# Altium schematic sheet jtag_connector.SchDoc
size A4
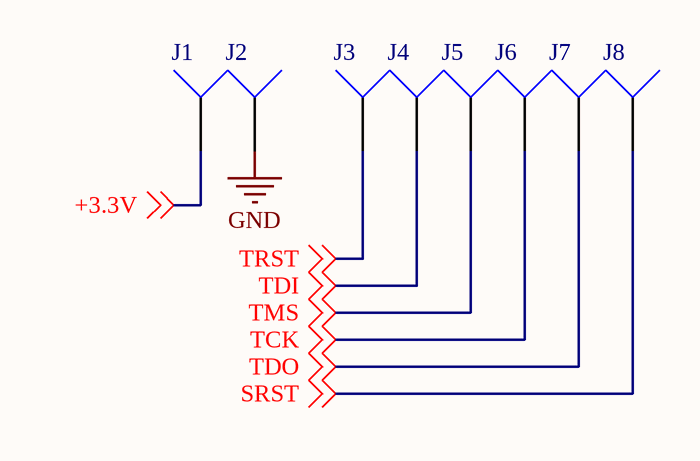
[diagram p0: jtag_connector.SchDoc]

## Parts
J1  Socket  [PIN1]  (value not drawn)
J2  Socket  [PIN1]  (value not drawn)
J3  Socket  [PIN1]  (value not drawn)
J4  Socket  [PIN1]  (value not drawn)
J5  Socket  [PIN1]  (value not drawn)
J6  Socket  [PIN1]  (value not drawn)
J7  Socket  [PIN1]  (value not drawn)
J8  Socket  [PIN1]  (value not drawn)

## Nets
GND: J2.1
+3.3V: J1.1 ; off-sheet +3.3V
SRST: J8.1 ; off-sheet SRST
TCK: J6.1 ; off-sheet TCK
TDI: J4.1 ; off-sheet TDI
TDO: J7.1 ; off-sheet TDO
TMS: J5.1 ; off-sheet TMS
TRST: J3.1 ; off-sheet TRST

## Library data of the parts
J1-J8 = Socket: LatestRevisionDate: 17-Jul-2002; LatestRevisionNote: Re-released for DXP Platform.; Publisher: Altium Limited